# EAGLE design outsidePromini (EAGLE 8.2.2)
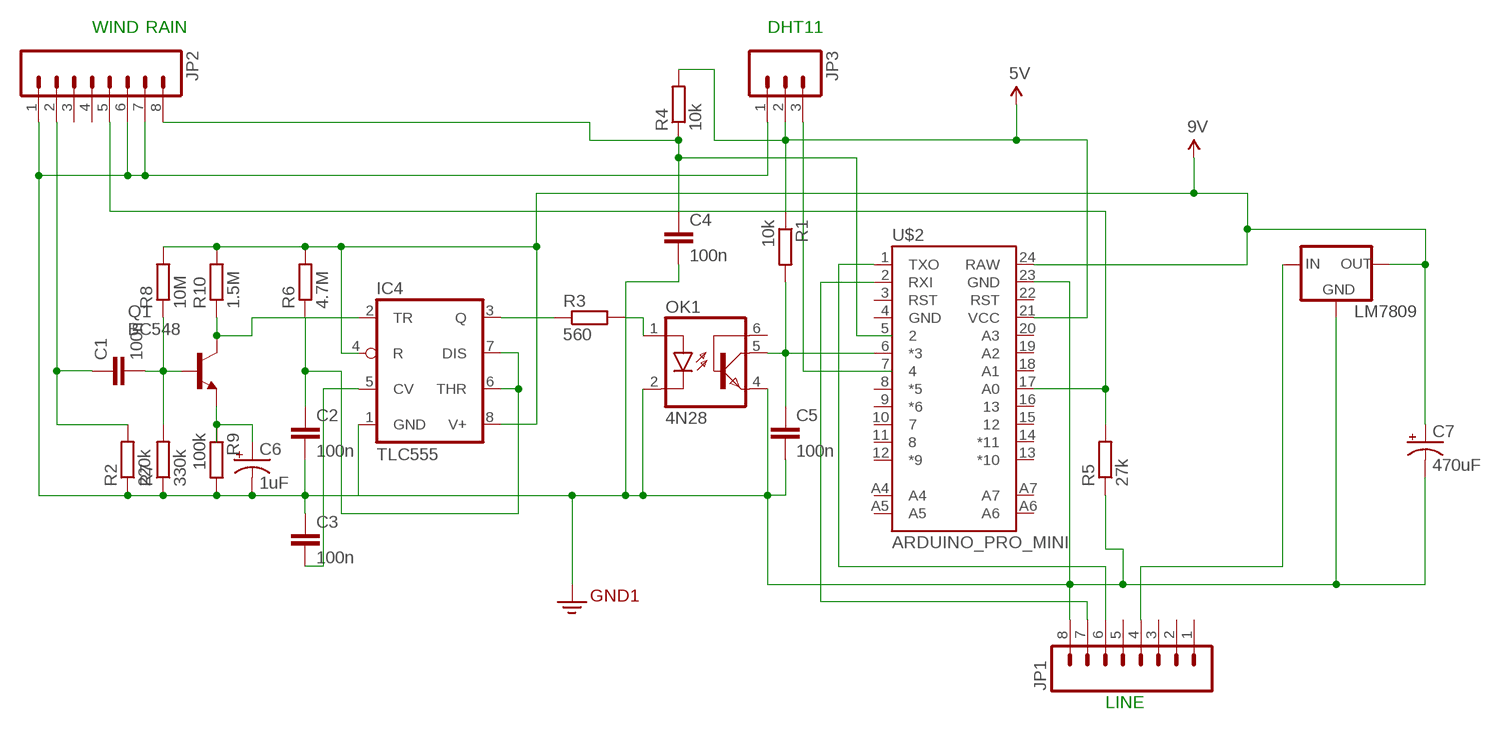
[diagram p0: schematic, sheet 1]

## Parts
C1  100n  0.1UF-50V-20%(PTH)KIT-EZ  [CAP-PTH-SMALL-KIT]
C2  100n  0.1UF-50V-20%(PTH)KIT-EZ  [CAP-PTH-SMALL-KIT]
C3  100n  0.1UF-50V-20%(PTH)KIT-EZ  [CAP-PTH-SMALL-KIT]
C4  100n  0.1UF-50V-20%(PTH)KIT-EZ  [CAP-PTH-SMALL-KIT]
C5  100n  0.1UF-50V-20%(PTH)KIT-EZ  [CAP-PTH-SMALL-KIT]
C6  1uF  CAP_POLPTH1  [CPOL-RADIAL-100UF-25V]
C7  470uF  CAP_POLPTH1  [CPOL-RADIAL-100UF-25V]
IC4  TLC555  LM555N  [DIL08]
JP1  M08LOCK_LONGPADS  [1X08_LOCK_LONGPADS]
JP2  M08LOCK_LONGPADS  [1X08_LOCK_LONGPADS]
JP3  M03LOCK_LONGPADS  [1X03_LOCK_LONGPADS]
LM7809  78XXS  [78XXS]
OK1  4N28  4N37  [DIL06]
Q1  BC548  [TO92-EBC]
R1  10k  R-EU_0204/5  [0204/5]
R2  220k  R-EU_0204/5  [0204/5]
R3  560  R-EU_0204/5  [0204/5]
R4  10k  R-EU_0204/5  [0204/5]
R5  27k  R-EU_0204/5  [0204/5]
R6  4.7M  R-EU_0204/5  [0204/5]
R7  330k  R-EU_0204/5  [0204/5]
R8  10M  R-EU_0204/5  [0204/5]
R9  100k  R-EU_0204/5  [0204/5]
R10  1.5M  R-EU_0204/5  [0204/5]
U$2  ARDUINO_PRO_MINI  [ARDUINO_PRO_MINI]

## Nets
3.3V: C2.2 C3.1 C4.2 C5.2 C6.2(-) C7.2(-) IC4.1(GND) JP1.8 JP2.1 JP2.6 JP2.7 JP3.1 LM7809.GND OK1.2(C) OK1.4(EMI) R2.1 R5.1 R7.1 R9.2 U$2.23(GND) ; supply symbol labelled GND
5V: C7.1(+) IC4.4(R) IC4.8(V+) JP3.2 LM7809.OUT R1.1 R4.2 R6.2 R8.2 R10.2 U$2.21(VCC) U$2.24(RAW) ; supply symbol labelled 9V
N$2: C1.1 JP2.2 R2.2
N$3: C1.2 Q1.B R7.2 R8.1
N$4: C6.1(+) Q1.E R9.1
N$5: C2.1 IC4.6(THR) IC4.7(DIS) R6.1
N$7: IC4.2(TR) Q1.C R10.1
N$8: IC4.3(Q) R3.1
N$9: C3.2 IC4.5(CV)
N$10: OK1.1(A) R3.2
N$11: JP1.4 LM7809.IN
N$12: JP1.7 U$2.2(RXI)
N$13: JP1.6 U$2.1(TXO)
N$14: JP3.3
N$16: C5.1 OK1.5(COL) R1.2 U$2.6(*3)
N$17: C4.1 JP2.8 R4.1
N$19: JP2.5 R5.2 U$2.17(A0)
Unconnected: JP1.1 JP1.2 JP1.3 JP1.5 JP2.3 JP2.4 OK1.6(BAS) U$2.3(RST) U$2.4(GND) U$2.5 U$2.7 U$2.8(*5) U$2.9(*6) U$2.10 U$2.11 U$2.12(*9) U$2.13(*10) U$2.14(*11) U$2.15 U$2.16 U$2.18(A1) U$2.19(A2) U$2.20(A3) U$2.22(RST) U$2.A4 U$2.A5 U$2.A6 U$2.A7

## Notes on the sheet
- WIND | RAIN | DHT11
- LINE

## Library data of the parts
C1-C5 = SparkFun-Capacitors:0.1UF-50V-20%(PTH): CAP-08370; PROD_ID: CAP-08370
C6 C7 = SparkFun-Capacitors:CAP_POL: Capacitor Polarized These are standard SMD and PTH capacitors. Normally 10uF, 47uF, and 100uF in electrolytic and tantalum varieties. Always verify the external diameter of the through hole cap, it varies with capacity, voltage, and manufacturer. The EIA devices should be standard.
IC4 = linear:*555: TIMER
JP1 JP2 = SparkFun-Connectors:M08: Header 8 Standard 8-pin 0.1" header. Use with straight break away headers (SKU : PRT-00116), right angle break away headers (PRT-00553), swiss pins (PRT-00743), machine pins (PRT-00117), and female headers (PRT-00115).
JP3 = SparkFun-Connectors:M03: Header 3 Standard 3-pin 0.1" header. Use with straight break away headers (SKU : PRT-00116), right angle break away headers (PRT-00553), swiss pins (PRT-00743), machine pins (PRT-00117), and female headers (PRT-00115). Molex polarized connector foot print use with SKU : PRT-08232 with associated crimp pins and housings.
LM7809 = v-reg:78XXS: VOLTAGE REGULATOR
OK1 = optocoupler:4N37: OPTO COUPLER Source: http://www.fairchildsemi.com/pf/4N/4N35-M.html; MF: FAIRCHILD SEMICONDUCTOR; MPN: 4N37; OC_FARNELL: 1612456; OC_NEWARK: 72K9948
Q1 = transistor-npn:BC548*: NPN Transistor
R1-R10 = resistor:R-EU_: RESISTOR, European symbol
U$2 = SparkFun-Boards:ARDUINO_PRO_MINI

## Board
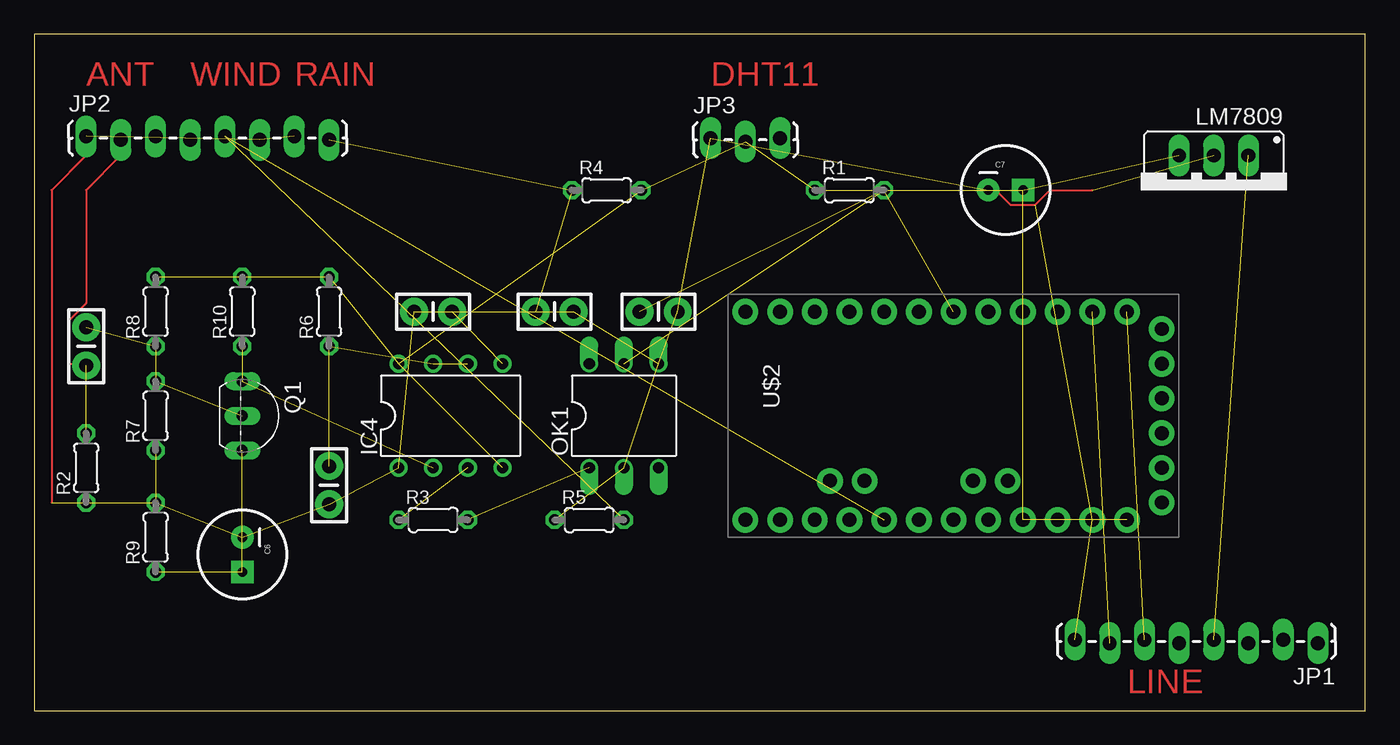
[diagram p1: board, top side]

Size 97.46 x 49.52 mm. Coordinates in mm from the lower left corner, seen from the top.
Outline: 0,0 97.46,0 97.46,49.52 0,49.52 0,0
Copper layers (1*16): Top 0.035mm / dielectric 1.5mm / Bottom 0.035mm
Design rules "default": minimum track width 6mil, minimum drill 0.35mm, track to track 6mil, track to pad 6mil, pad to pad 6mil, via to via 6mil, smd to smd 6mil, copper to edge 40mil, drill to drill 6mil, minimum pad ring 10mil, minimum via ring 8mil, stop-mask expansion 4mil, vias tented up to drill 0mil, thermal gap 10mil

### Footprints (pad centres in the part's own frame; a part is rotated, then mirrored left to right if it is on the bottom)
CAP-PTH-SMALL-KIT = drill 1.016 pad 2.032: 1 -1.397,0; 2 1.397,0
CPOL-RADIAL-100UF-25V = drill 0.7 pad 1.651 square: 1 1.27,0 | drill 0.7 pad 1.651: 2 -1.27,0
DIL08 = drill 0.813 pad 1.27: 1 -3.81,-3.81; 2 -1.27,-3.81; 3 1.27,-3.81; 4 3.81,-3.81; 5 3.81,3.81; 6 1.27,3.81; 7 -1.27,3.81; 8 -3.81,3.81
1X08_LOCK_LONGPADS = drill 1.016 long: 1 0,0.127; 2 2.54,-0.127; 3 5.08,0.127; 4 7.62,-0.127; 5 10.16,0.127; 6 12.7,-0.127; 7 15.24,0.127; 8 17.78,-0.127
1X03_LOCK_LONGPADS = drill 1.016 long: 1 0,0; 2 2.54,-0.254; 3 5.08,0
78XXS = drill 1.016 long: GND 0,-2.54; IN -2.54,-2.54; OUT 2.54,-2.54
DIL06 = drill 0.813 offset: 1 -2.54,-3.81; 2 0,-3.81; 3 2.54,-3.81; 4 2.54,3.81; 5 0,3.81; 6 -2.54,3.81
TO92-EBC = drill 0.813 long: B 0,-1.27; C -2.54,-1.27; E 2.54,-1.27
0204/5 = drill 0.813 octagon: 1 -2.54,0; 2 2.54,0
ARDUINO_PRO_MINI = drill 1.016 pad 1.88: 1 -7.62,12.7; 2 -7.62,10.16; 3 -7.62,7.62; 4 -7.62,5.08; 5 -7.62,2.54; 6 -7.62,0; 7 -7.62,-2.54; 8 -7.62,-5.08; 9 -7.62,-7.62; 10 -7.62,-10.16; 11 -7.62,-12.7; 12 -7.62,-15.24; 13 7.62,-15.24; 14 7.62,-12.7; 15 7.62,-10.16; 16 7.62,-7.62; 17 7.62,-5.08; 18 7.62,-2.54; 19 7.62,0; 20 7.62,2.54; 21 7.62,5.08; 22 7.62,7.62; 23 7.62,10.16; 24 7.62,12.7; A4 4.763,1.429; A5 4.763,3.969; A6 4.763,-9.049; A7 4.763,-6.509; BLK -6.35,15.24; GND -3.81,15.24; GRN 6.35,15.24; RXI 1.27,15.24; TXO 3.81,15.24; VCC -1.27,15.24

### Placement (x,y rotation side)
C1  3.81,26.67 90 top
C2  21.59,16.51 270 top
C3  29.21,29.21 0 top
C4  38.1,29.21 0 top
C5  45.72,29.21 0 top
C6  15.24,11.43 270 top
C7  71.12,38.1 0 top
IC4  30.48,21.59 0 top
JP1  93.98,5.08 180 top
JP2  3.81,41.91 0 top
JP3  49.53,41.91 0 top
LM7809  86.36,38.1 180 top
OK1  43.18,21.59 0 top
Q1  16.51,21.59 270 top
R1  59.69,38.1 0 top
R2  3.81,17.78 90 top
R3  29.21,13.97 0 top
R4  41.91,38.1 0 top
R5  40.64,13.97 0 top
R6  21.59,29.21 90 top
R7  8.89,21.59 90 top
R8  8.89,29.21 90 top
R9  8.89,12.7 90 top
R10  15.24,29.21 90 top
U$2  67.31,21.59 270 top

### Tracks (layer width: path | path; a pad name or v marks a point on that pad's centre or on a via)
3.3V  (19 unrouted)
  Top 0.152: JP2.1 3.81,40.64 1.27,38.1 1.27,15.24 | C7.2 70.42,38.1 71.47,37.05 73.31,37.05 74.36,38.1 77.47,38.1
5V  (11 unrouted)
N$2  (1 unrouted)
  Top 0.152: JP2.2 6.35,40.64 3.81,38.1 3.81,29.83 2.56,28.58 2.56,25.42 2.54,25.4 3.68,25.4 C1.1
N$3  (3 unrouted)
N$4  (2 unrouted)
N$5  (3 unrouted)
N$7  (2 unrouted)
N$8  (1 unrouted)
N$9  (1 unrouted)
N$10  (1 unrouted)
N$11  (1 unrouted)
N$12  (1 unrouted)
N$13  (1 unrouted)
N$16  (3 unrouted)
N$17  (2 unrouted)
N$19  (2 unrouted)

### Text on the board
Top: ANT | WIND | RAIN | DHT11 | LINE